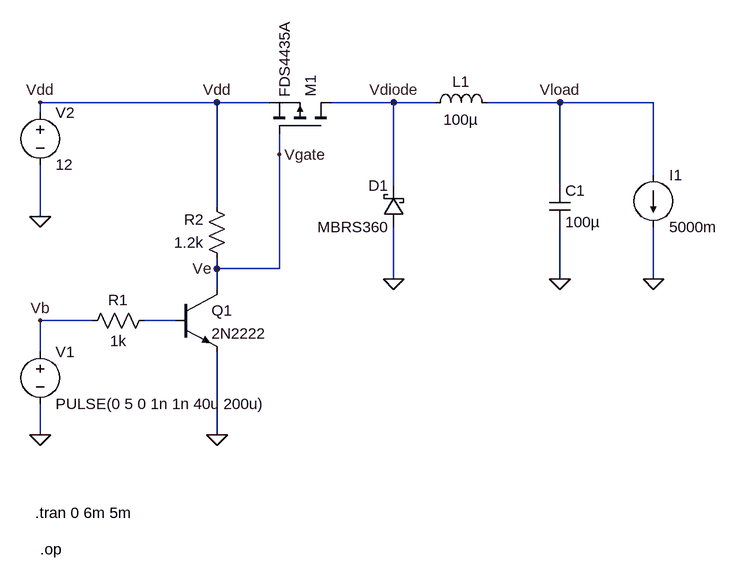
[diagram p0: schematic High side drived Buck(Open collector).asc]
High side drived Buck(Open collector).asc, the LTspice schematic file:
Version 4
SHEET 1 1116 680
WIRE 336 -176 64 -176
WIRE 416 -176 336 -176
WIRE 608 -176 512 -176
WIRE 672 -176 608 -176
WIRE 864 -176 752 -176
WIRE 1008 -176 864 -176
WIRE 64 -160 64 -176
WIRE 432 -96 432 -128
WIRE 1008 -64 1008 -176
WIRE 608 -48 608 -176
WIRE 864 -48 864 -176
WIRE 336 -16 336 -176
WIRE 64 0 64 -80
WIRE 336 80 336 64
WIRE 432 80 432 -96
WIRE 432 80 336 80
WIRE 608 96 608 16
WIRE 864 96 864 16
WIRE 1008 96 1008 16
WIRE 336 112 336 80
WIRE 144 160 64 160
WIRE 272 160 224 160
WIRE 64 208 64 160
WIRE 64 336 64 288
WIRE 336 336 336 208
FLAG 608 96 0
FLAG 864 96 0
FLAG 1008 96 0
FLAG 336 336 0
FLAG 64 336 0
FLAG 64 0 0
FLAG 64 -176 Vdd
FLAG 432 -96 Vgate
FLAG 864 -176 Vload
FLAG 608 -176 Vdiode
FLAG 336 -176 Vdd
FLAG 64 160 Vb
FLAG 336 80 Ve
SYMBOL voltage 64 192 R0
WINDOW 123 0 0 Left 0
WINDOW 39 0 0 Left 0
SYMATTR InstName V1
SYMATTR Value PULSE(0 5 0 1n 1n 40u 200u)
SYMBOL voltage 64 -176 R0
WINDOW 123 0 0 Left 0
WINDOW 39 0 0 Left 0
SYMATTR InstName V2
SYMATTR Value 12
SYMBOL res 240 144 R90
WINDOW 0 0 56 VBottom 2
WINDOW 3 32 56 VTop 2
SYMATTR InstName R1
SYMATTR Value 1k
SYMBOL res 352 80 R180
WINDOW 0 36 76 Left 2
WINDOW 3 36 40 Left 2
SYMATTR InstName R2
SYMATTR Value 1.2k
SYMBOL pmos 512 -128 M270
SYMATTR InstName M1
SYMATTR Value FDS4435A
SYMBOL schottky 624 16 R180
WINDOW 0 24 64 Left 2
WINDOW 3 24 0 Left 2
SYMATTR InstName D1
SYMATTR Value MBRS360
SYMATTR Description Diode
SYMATTR Type diode
SYMBOL ind 656 -160 R270
WINDOW 0 32 56 VTop 2
WINDOW 3 5 56 VBottom 2
SYMATTR InstName L1
SYMATTR Value 100µ
SYMBOL cap 848 -48 R0
SYMATTR InstName C1
SYMATTR Value 100µ
SYMBOL current 1008 -64 R0
WINDOW 123 0 0 Left 0
WINDOW 39 0 0 Left 0
SYMATTR InstName I1
SYMATTR Value 5000m
SYMBOL npn 272 112 R0
SYMATTR InstName Q1
SYMATTR Value 2N2222
TEXT 56 456 Left 2 !.tran 0 6m 5m
TEXT 64 512 Left 2 !.op

The netlist it stands for:
* High side drived Buck(Open collector).asc
V1 Vb 0 PULSE(0 5 0 1n 1n 40u 200u)
V2 Vdd 0 12
R1 N001 Vb 1k
R2 Ve Vdd 1.2k
M1 Vdiode Ve Vdd Vdd FDS4435A
D1 0 Vdiode MBRS360
L1 Vdiode Vload 100µ
C1 Vload 0 100µ
I1 Vload 0 5000m
Q1 Ve N001 0 0 2N2222
.model D D
.lib standard.dio
.model NPN NPN
.model PNP PNP
.lib standard.bjt
.model NMOS NMOS
.model PMOS PMOS
.lib standard.mos
.tran 0 6m 5m
.op
.backanno
.end